# EAGLE design BB-M-1_0 (EAGLE 6.5.0)

## Sheet 1 of 3
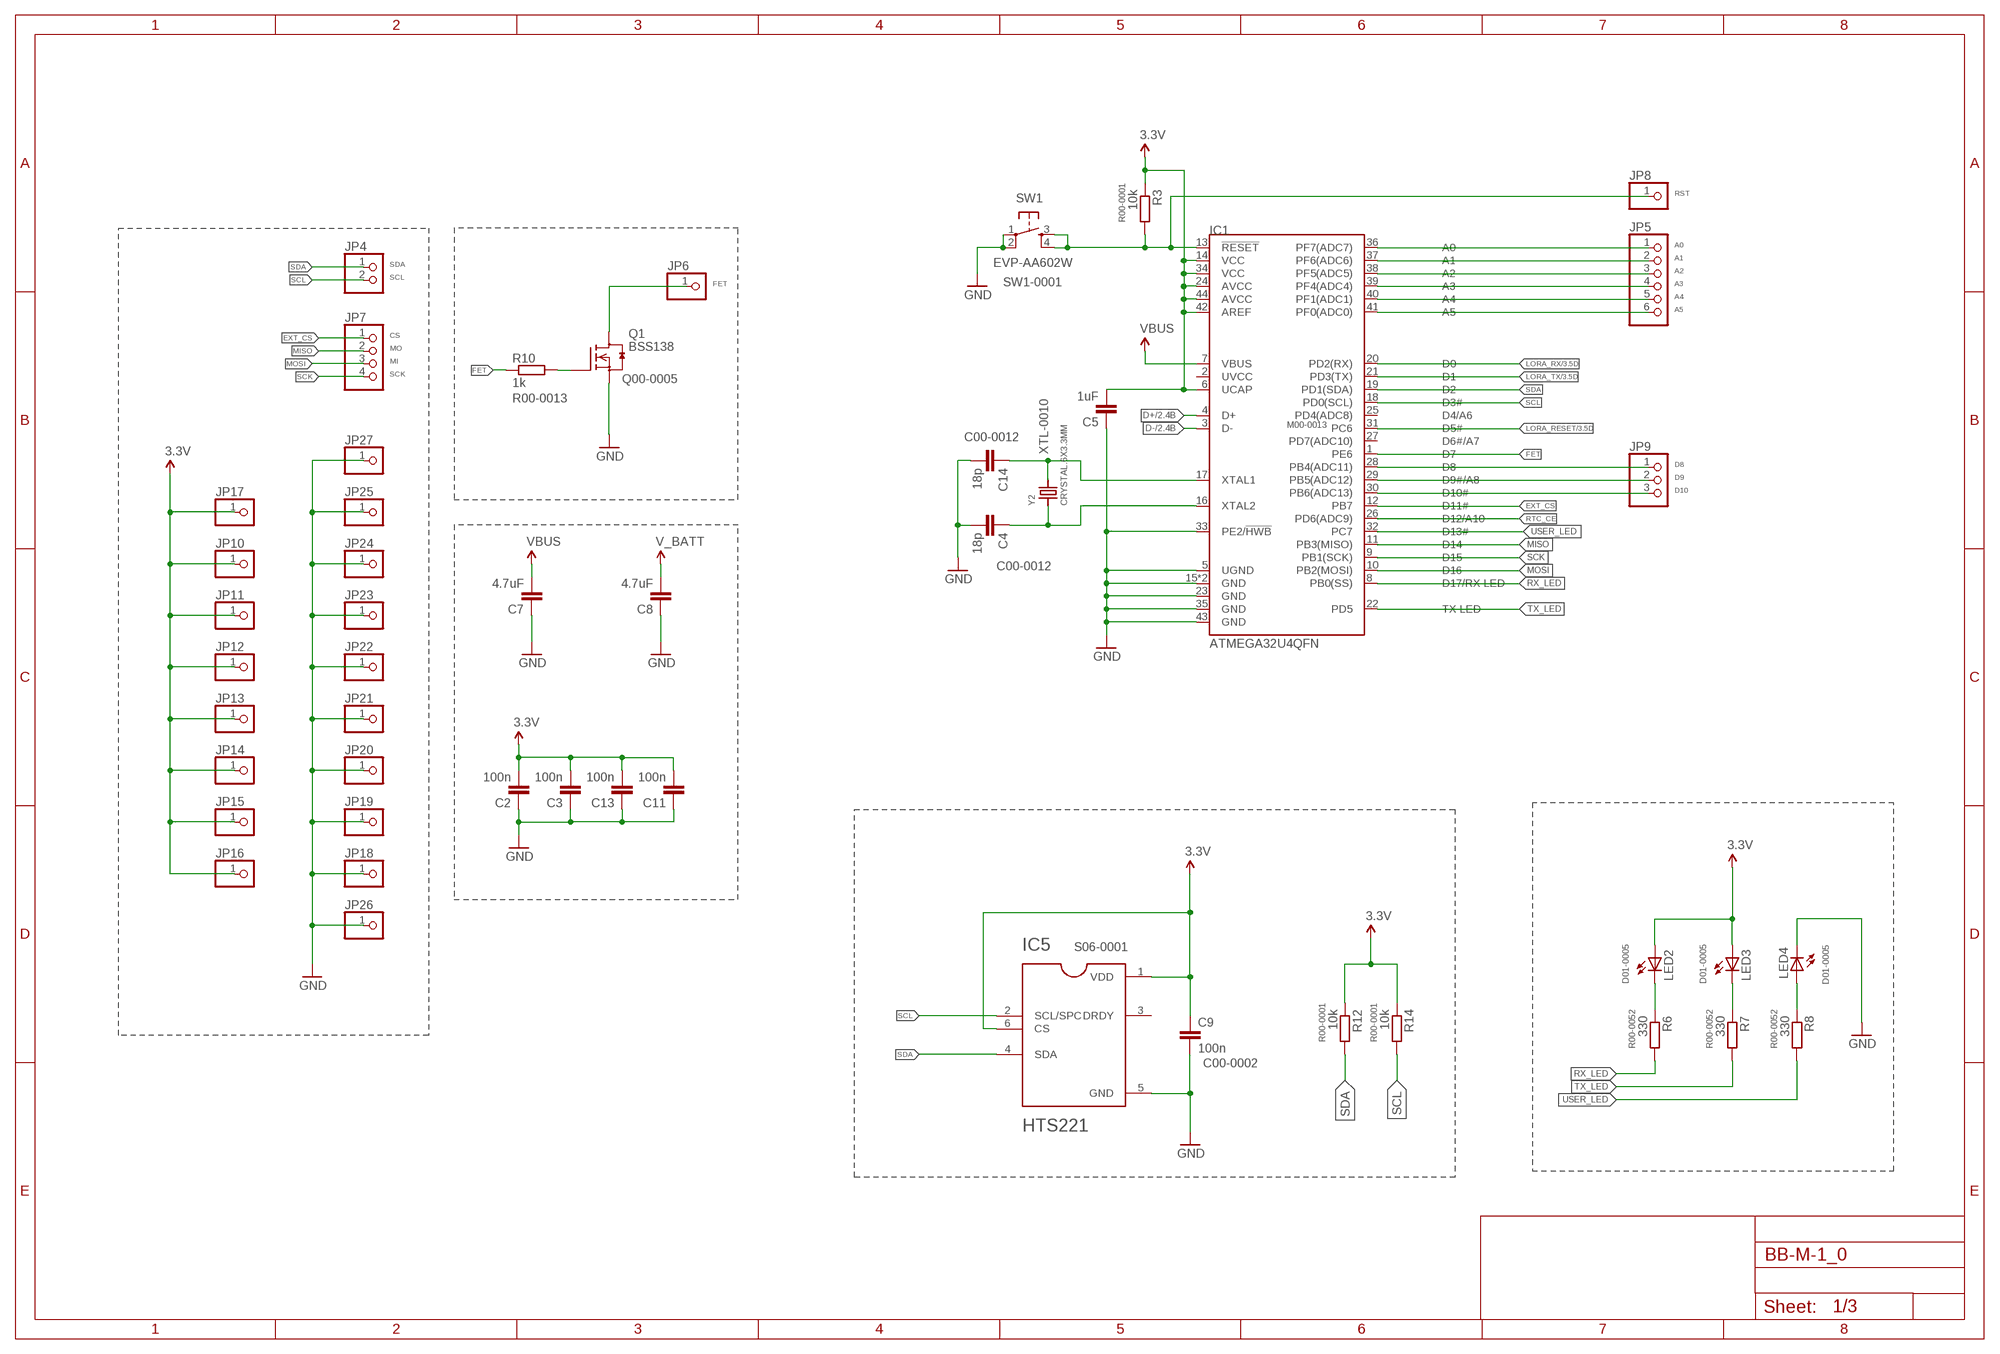
[diagram p0: schematic, sheet 1]

### Parts
C2  100n  C-EUC0402  [C0402]
C3  100n  C-EUC0402  [C0402]
C4  18p  C-EUC0402  [C0402]
C5  1uF  C-EUC0402  [C0402]
C7  4.7uF  C-EUC0603  [C0603]
C8  4.7uF  C-EUC0603  [C0603]
C9  100n  C-EUC0402  [C0402]
C11  100n  C-EUC0402  [C0402]
C13  100n  C-EUC0402  [C0402]
C14  18p  C-EUC0402  [C0402]
IC1  ATMEGA32U4QFN  [QFN-44]
IC5  HTS221  [LGA6R75P3X2_200X200X90]
JP4  HEADER-1X2ROUND  [1X02_ROUND]
JP5  HEADER-1X6ROUND  [1X06_ROUND]
JP6  HEADER-1X1ROUND  [1X01_ROUND]
JP7  HEADER-1X4ROUND  [1X04_ROUND]
JP8  HEADER-1X1ROUND  [1X01_ROUND]
JP9  HEADER-1X3ROUND  [1X03_ROUND]
JP10  HEADER-1X1ROUND  [1X01_ROUND]
JP11  HEADER-1X1ROUND  [1X01_ROUND]
JP12  HEADER-1X1ROUND  [1X01_ROUND]
JP13  HEADER-1X1ROUND  [1X01_ROUND]
JP14  HEADER-1X1ROUND  [1X01_ROUND]
JP15  HEADER-1X1ROUND  [1X01_ROUND]
JP16  HEADER-1X1ROUND  [1X01_ROUND]
JP17  HEADER-1X1ROUND  [1X01_ROUND]
JP18  HEADER-1X1ROUND  [1X01_ROUND]
JP19  HEADER-1X1ROUND  [1X01_ROUND]
JP20  HEADER-1X1ROUND  [1X01_ROUND]
JP21  HEADER-1X1ROUND  [1X01_ROUND]
JP22  HEADER-1X1ROUND  [1X01_ROUND]
JP23  HEADER-1X1ROUND  [1X01_ROUND]
JP24  HEADER-1X1ROUND  [1X01_ROUND]
JP25  HEADER-1X1ROUND  [1X01_ROUND]
JP26  HEADER-1X1ROUND  [1X01_ROUND]
JP27  HEADER-1X1ROUND  [1X01_ROUND]
LED2  LED0603  [LED-0603]
LED3  LED0603  [LED-0603]
LED4  LED0603  [LED-0603]
Q1  BSS138  [SOT23]
R3  10k  R-EU_R0402  [R0402]
R6  330  R-EU_R0402  [R0402]
R7  330  R-EU_R0402  [R0402]
R8  330  R-EU_R0402  [R0402]
R10  1k  R-EU_R0402  [R0402]
R12  10k  R-EU_R0402  [R0402]
R14  10k  R-EU_R0402  [R0402]
SW1  EVP-AA602W  SPST_TACT  [UUS_BUTTON]
Y2  CRYSTAL.6X3.3MM  [6X3.3MM]

### Nets
3.3V: C2.2 C3.2 C5.2 C9.1 C11.2 C13.2 IC1.6(UCAP) IC1.14(VCC) IC1.24(AVCC) IC1.34(VCC) IC1.42(AREF) IC1.44(AVCC) IC5.1(VDD) IC5.6(CS) JP10.1 JP11.1 JP12.1 JP13.1 JP14.1 JP15.1 JP16.1 JP17.1 LED2.A LED3.A R3.1 R12.1 R14.1 ; also sheet 2,3
5V: C7.2 IC1.7(VBUS) ; supply symbol labelled VBUS ; also sheet 2
D+: IC1.4(D+) ; also sheet 2
D-: IC1.3(D-) ; also sheet 2
EXT_CS: IC1.12(PB7) JP7.1
FET: IC1.1(PE6) R10.1
FET_OUTPUT: JP6.1 Q1.3(D)
GND: C2.1 C3.1 C4.2 C5.1 C7.1 C8.1 C9.2 C11.1 C13.1 C14.2 IC1.5(UGND) IC1.15(GND) IC1.23(GND) IC1.33(PE2/!HWB) IC1.35(GND) IC1.43(GND) IC1.EPAD(GND) IC5.5(GND) JP18.1 JP19.1 JP20.1 JP21.1 JP22.1 JP23.1 JP24.1 JP25.1 JP26.1 JP27.1 LED4.C Q1.2(S) SW1.1(P) SW1.2(P1) ; also sheet 2,3
LORA_RESET: IC1.31(PC6) ; also sheet 3
LORA_RX: IC1.20(PD2(RX)) ; also sheet 3
LORA_TX: IC1.21(PD3(TX)) ; also sheet 3
MISO: IC1.11(PB3(MISO)) JP7.2
MOSI: IC1.10(PB2(MOSI)) JP7.3
N$1: LED2.C R6.1
N$5: C14.1 IC1.17(XTAL1) Y2.2
N$7: C4.1 IC1.16(XTAL2) Y2.1
N$10: IC1.30(PB6(ADC13)) JP9.3
N$11: IC1.29(PB5(ADC12)) JP9.2
N$12: Q1.1(G) R10.2
N$13: IC1.36(PF7(ADC7)) JP5.1
N$14: IC1.41(PF0(ADC0)) JP5.6
N$15: IC1.40(PF1(ADC1)) JP5.5
N$16: IC1.39(PF4(ADC4)) JP5.4
N$17: IC1.38(PF5(ADC5)) JP5.3
N$18: LED4.A R8.1
N$21: LED3.C R7.1
N$25: IC1.37(PF6(ADC6)) JP5.2
N$28: IC1.28(PB4(ADC11)) JP9.1
RESET: IC1.13(!RESET) JP8.1 R3.2 SW1.3(S) SW1.4(S1)
RTC_CE: IC1.26(PD6(ADC9))
RX_LED: IC1.8(PB0(SS)) R6.2
SCK: IC1.9(PB1(SCK)) JP7.4
SCL: IC1.18(PD0(SCL)) IC5.2(SCL/SPC) JP4.2 R14.2
SDA: IC1.19(PD1(SDA)) IC5.4(SDA) JP4.1 R12.2
TX_LED: IC1.22(PD5) R7.2
USER_LED: IC1.32(PC7) R8.2
V_BATT: C8.2 ; also sheet 2
Unconnected: IC1.2(UVCC) IC1.25(PD4(ADC8)) IC1.27(PD7(ADC10)) IC5.3(DRDY)

### Notes on the sheet
- RST
- A0
- A1
- SDA
- A2
- SCL
- FET | A3
- A4
- A5
- CS
- MO
- MI
- SCK
- D8
- D9
- D10

## Sheet 2 of 3
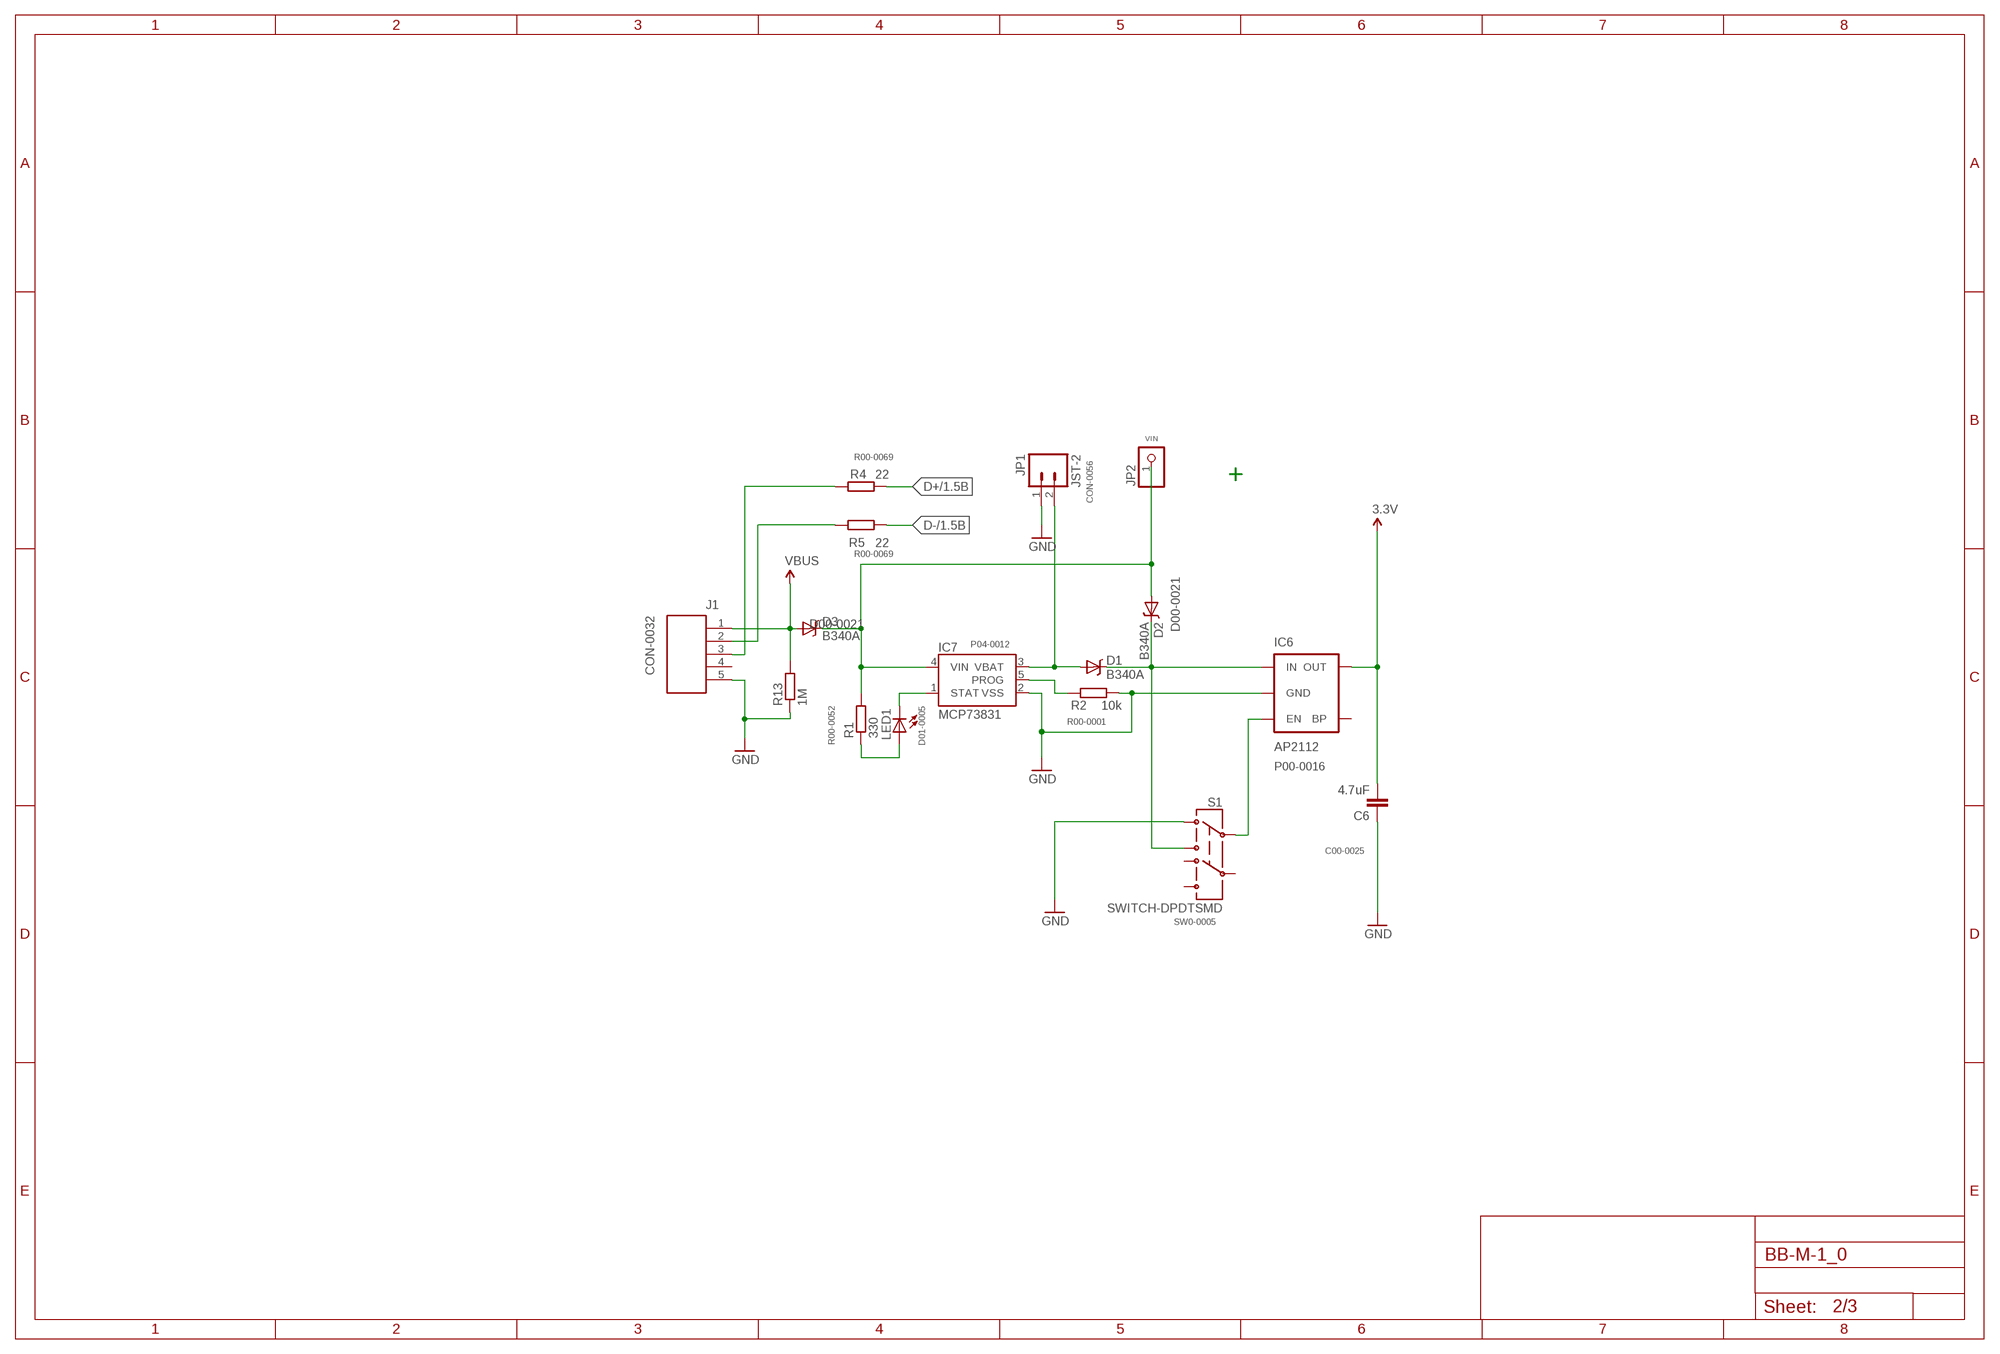
[diagram p1: schematic, sheet 2]

### Parts
C6  4.7uF  C-EUC0603  [C0603]
D1  B340A  DIODE-SCHOTTKY_  [SMA-DIODE]
D2  B340A  DIODE-SCHOTTKY_  [SMA-DIODE]
D3  B340A  DIODE-SCHOTTKY_  [SMA-DIODE]
IC6  AP2112  V_REG_MIC5219SMD  [SOT23-5]
IC7  MCP73831  [SOT23-5]
J1  629105136821  [629105136821]
JP1  JST-2  M02-JST-2MM-SMT  [JST-2-SMD]
JP2  PINHD-1X1CB  [1X01-CLEANBIG]
LED1  LED0603  [LED-0603]
R1  330  R-EU_R0402  [R0402]
R2  10k  R-EU_R0402  [R0402]
R4  22  R-EU_R0402  [R0402]
R5  22  R-EU_R0402  [R0402]
R13  1M  R-EU_R0402  [R0402]
S1  SWITCH-DPDTSMD  [AYZ0202]

### Nets
3.3V: C6.2 IC6.5(OUT) ; also sheet 1,3
5V: D3.A J1.1 R13.2 ; supply symbol labelled VBUS ; also sheet 1
D+: R4.1 ; also sheet 1
D-: R5.1 ; also sheet 1
GND: C6.1 IC6.2(GND) IC7.2(VSS) J1.5 JP1.1 R2.1 R13.1 S1.1 ; also sheet 1,3
N$2: D1.C D2.C IC6.1(IN) S1.3
N$3: LED1.A R1.1
N$4: IC7.1(STAT) LED1.C
N$6: IC7.5(PROG) R2.2
N$8: IC6.3(EN) S1.2
N$19: J1.2 R5.2
N$20: J1.3 R4.2
N$29: D2.A D3.C IC7.4(VIN) JP2.1 R1.2
V_BATT: D1.A IC7.3(VBAT) JP1.2 ; also sheet 1
Unconnected: IC6.4(BP) J1.4 S1.4 S1.5 S1.6

### Notes on the sheet
- VIN
- +

## Sheet 3 of 3
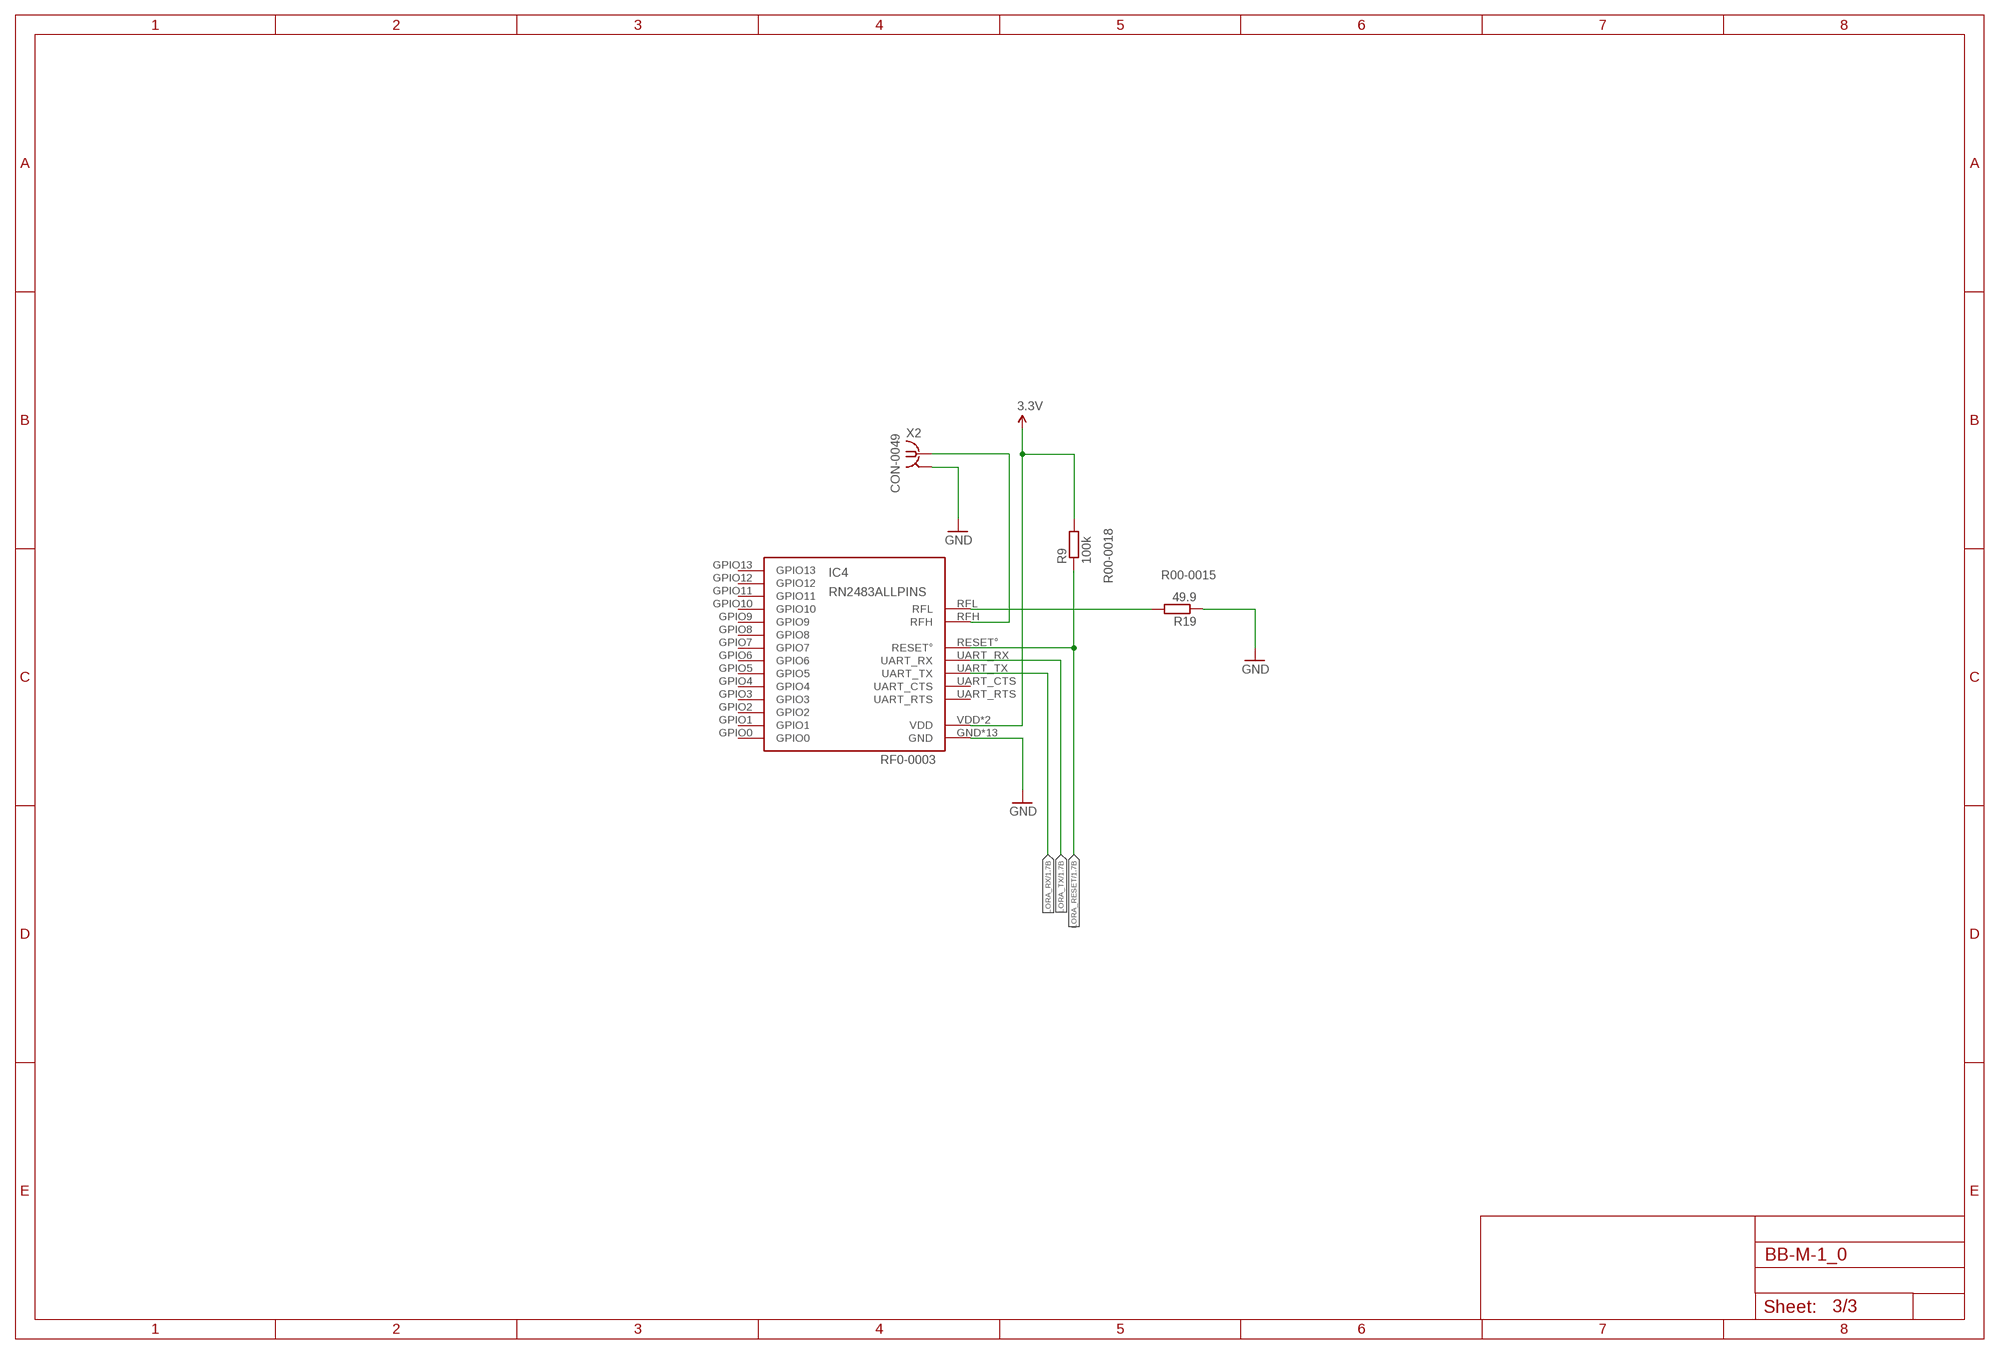
[diagram p2: schematic, sheet 3]

### Parts
IC4  RN2483ALLPINS  [RN2483]
R9  100k  R-EU_R0402  [R0402]
R19  49.9  R-EU_R0402  [R0402]
X2  132414  [132414]

### Nets
3.3V: IC4.VDD IC4.VDD2(VDD) R9.2 ; also sheet 1,2
GND: IC4.GND IC4.GND1(GND) IC4.GND2(GND) IC4.GND3(GND) IC4.GND4(GND) IC4.GND5(GND) IC4.GND6(GND) IC4.GND7(GND) IC4.GND8(GND) IC4.GND9(GND) IC4.GND10(GND) IC4.GND11(GND) IC4.GND12(GND) R19.1 X2.G@1(GND) X2.G@2(GND) X2.G@3(GND) X2.G@4(GND) ; also sheet 1,2
LORA_RESET: IC4.RESET° R9.1 ; also sheet 1
LORA_RX: IC4.UART_TX ; also sheet 1
LORA_TX: IC4.UART_RX ; also sheet 1
N$30: IC4.RFL R19.2
N$34: IC4.RFH X2.1
Unconnected: IC4.GPIO0 IC4.GPIO1 IC4.GPIO2 IC4.GPIO3 IC4.GPIO4 IC4.GPIO5 IC4.GPIO6 IC4.GPIO7 IC4.GPIO8 IC4.GPIO9 IC4.GPIO10 IC4.GPIO11 IC4.GPIO12 IC4.GPIO13 IC4.UART_CTS IC4.UART_RTS

## Library data of the parts
C2 C3 C9 C11 C13 = passive_comp:C-EU: CAPACITOR, European symbol; NASPN: C00-0002
C4 C14 = passive_comp:C-EU: CAPACITOR, European symbol; NASPN: C00-0012
C5 = passive_comp:C-EU: CAPACITOR, European symbol; NASPN: C00-0008
C6-C8 = passive_comp:C-EU: CAPACITOR, European symbol; NASPN: C00-0025
D1-D3 = SparkFun-DiscreteSemi:DIODE-SCHOTTKY: Commonly MBRA140.; NASPN: D00-0021
IC1 = SparkFun-DigitalIC:ATMEGA32U4: Atmel 44-pin 8-bit Microcontroller with 32KBytes of ISP Flash and USB Controller; NASPN: M00-0013
IC4 = LORA:RN2483: RN2483 Microchip Low-Power Lora Transceiver Module NOT TESTED There are testpads on the bottom of the device. The mask is supposed to cover that, but I have not tested it in practice yet. Info: http://www.microchip.com/wwwproducts/Devices.aspx?product=RN2483 Datasheet: http://ww1.microchip.com/downloads/en/DeviceDoc/50002346B.pdf Adapted from: https://github.com/Octanis1/Octanis1-Electronics/blob/ae493cac28c100e20856abe563dfe8824e9cc4bd/lib/Octanis1.lbr; NASPN: RF0-0003
IC5 = HTS221:HTS221: Capacitive digital sensor for relative humidity and temperature; NASPN: S06-0001
IC6 = SparkFun-PowerIC:V_REG_MIC5219: V_REG MIC5219 Standard 500mA LDO voltage regulator in SOT-23 layout. Micrel part MIC5219. BP (by-pass) pin is used to lower output noise with 470pF cap, may be left open.; NASPN: P00-0016
IC7 = SparkFun-PowerIC:MCP73831: Miniature single cell, fully integrated Li-Ion, Li-polymer charge management controller http://ww1.microchip.com/downloads/en/DeviceDoc/21984a.pdf; NASPN: P04-0012
J1 = EAGLE-INPUT_OUTPUT_CONNECTORS-rev1:629105136821: WR-COM SMT Horizontal 5 Contacts Micro USB Type B,5 pins=>Code : Con_I-O_COM_MicroUSB_629105136821 <http://katalog.we-online.de/media/images/eican/Con_I-O_COM_MicroUSB_629105136821_pf2.jpg> Details see: http://katalog.we-online.de/en/em/629_105_136_821 Created 2014-07-09, Karrer Zheng 2014 (C) Würth Elektronik; NASPN: CON-0032
JP1 = SparkFun-Connectors:M02: Header 2 Standard 2-pin 0.1" header. Use with straight break away headers (SKU : PRT-00116), right angle break away headers (PRT-00553), swiss pins (PRT-00743), machine pins (PRT-00117), and female headers (PRT-00115). Molex polarized connector foot print use with SKU : PRT-08233 with associated crimp pins and housings.; NASPN: CON-0056
JP2 = adafruit:PINHD-1X1: Pin header 1x1 for 0.1" spacing With round pins
JP4 = microbuilder:HEADER-1X2: PIN HEADER
JP5 = microbuilder:HEADER-1X6: PIN HEADER
JP6 JP8 JP10-JP27 = microbuilder:HEADER-1X1: PIN HEADER
JP7 = microbuilder:HEADER-1X4: PIN HEADER
JP9 = microbuilder:HEADER-1X3: PIN HEADER
LED1-LED4 = SparkFun-LED:LED: LEDs Standard schematic elements and footprints for 5mm, 3mm, 1206, and 0603 sized LEDs. 5mm - Spark Fun Electronics SKU : COM-00529 (and others); NASPN: D01-0005
Q1 = MAX9812:BSS138: Fairchild Semiconductors BSS138 N-Channel Logic Level Enhancement Mode Field Effect Transistor General Description: These N-Channel enhancement mode field effect transistors are produced using Fairchild's proprietary, high cell density, DMOS technology. These products have been designed to minimize on-state resistance while provide rugged, reliable, and fast switching performance.These products are particularly suited for low voltage, low current applications such as small servo motor control, power MOSFET gate drivers, and other switching applications. Features: 0.22 A, 50 V. RDS(ON) = 3.5Ohm @ VGS = 10 V RDS(ON) = 6.0Ohm @ VGS = 4.5 V High density cell design for extremely low RDS(ON) Rugged and Reliable Compact industry standard SOT-23 surface mount package Please send any comments to: messi@users.sourceforge.net; NASPN: Q00-0005
R1 R6-R8 = passive_comp:R-EU_: RESISTOR, European symbol; NASPN: R00-0052
R2 R3 R12 R14 = passive_comp:R-EU_: RESISTOR, European symbol; NASPN: R00-0001
R4 R5 = passive_comp:R-EU_: RESISTOR, European symbol; NASPN: R00-0069
R9 = passive_comp:R-EU_: RESISTOR, European symbol; NASPN: R00-0018
R10 = passive_comp:R-EU_: RESISTOR, European symbol; NASPN: R00-0013
R13 = passive_comp:R-EU_: RESISTOR, European symbol; NASPN: R00-0004
R19 = passive_comp:R-EU_: RESISTOR, European symbol; NASPN: R00-0015
S1 = SparkFun-Electromechanical:SWITCH-DPDT: DPDT Version of the COM-00597; NASPN: SW0-0005
SW1 = adafruit:SPST_TACT: SMT 6mm switch, EVQQ2 series http://www.ladyada.net/library/eagle; NASPN: SW1-0001
X2 = con-coax:132414; NASPN: CON-0049
Y2 = abracon:CRYSTAL; NASPN: XTL-0010

## Board
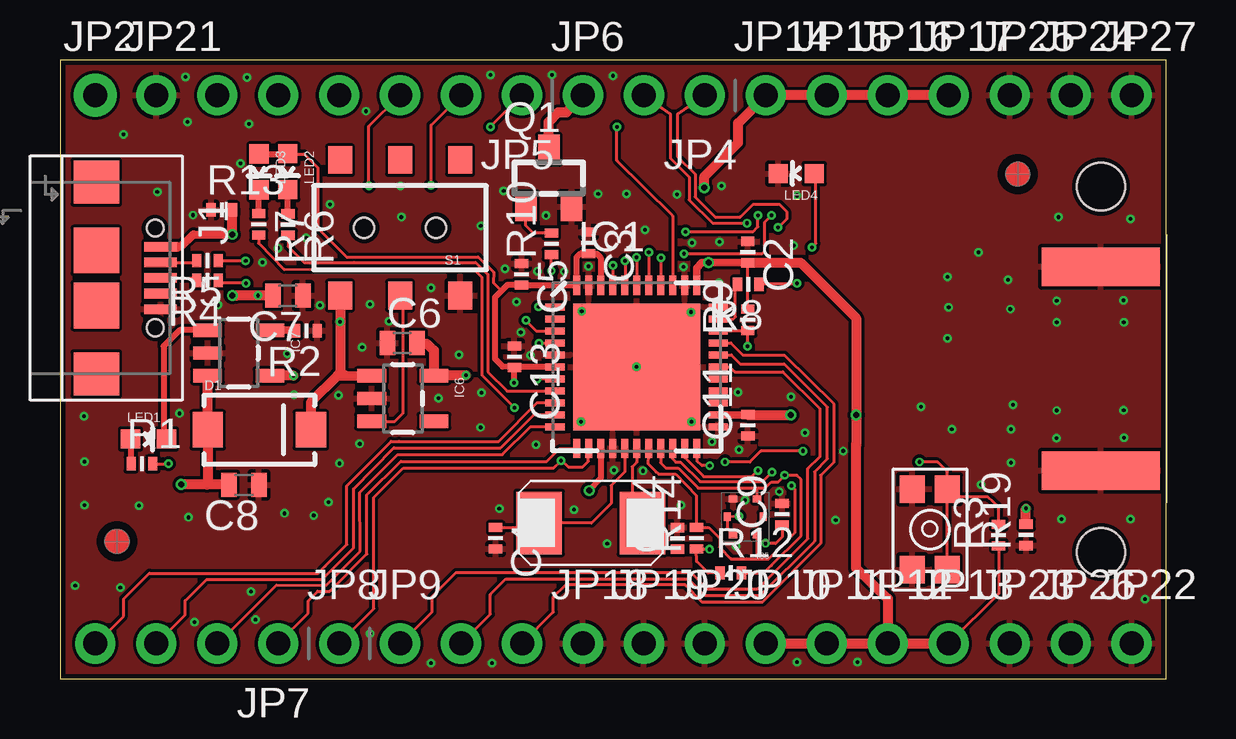
[diagram p3: board, top side]
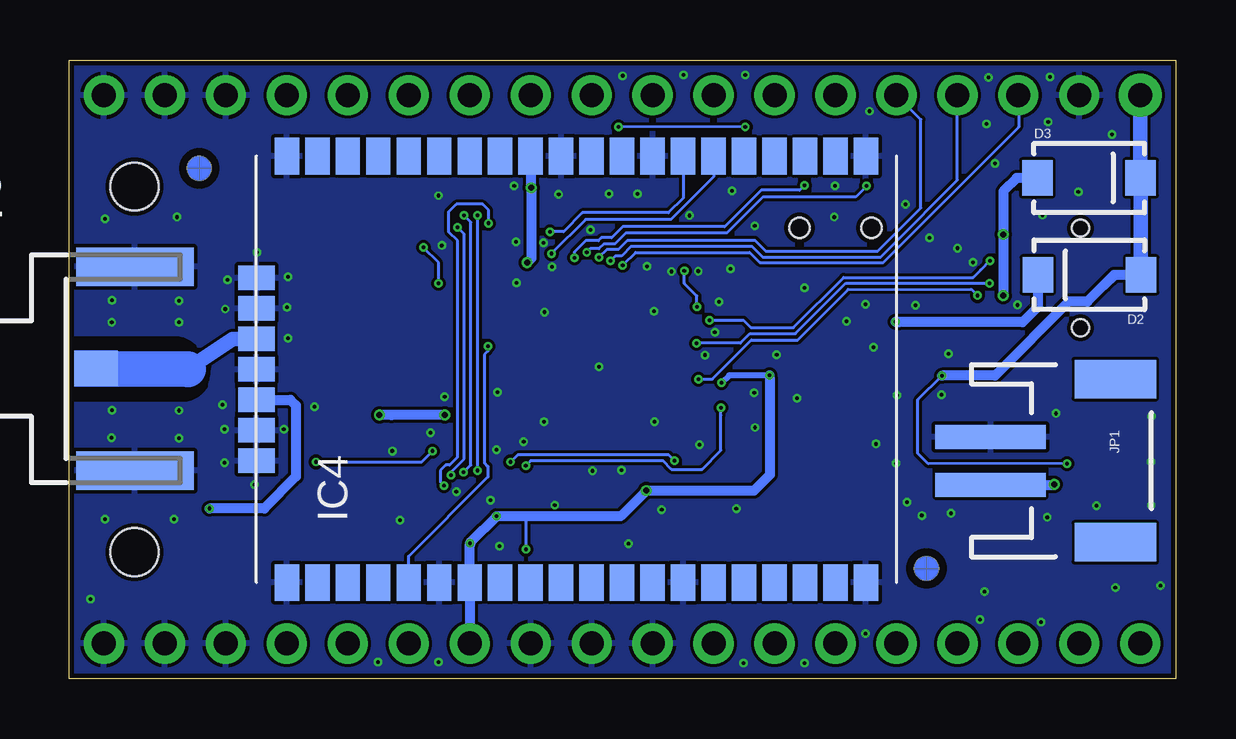
[diagram p4: board, bottom side, seen from below]

Size 46.11 x 25.8 mm. Coordinates in mm from the lower left corner, seen from the top.
Outline: 0,0 46.1,0 46.1,25.8 0,25.8 0,0
Copper layers (1*16): Top 0.012mm / dielectric 1mm / Bottom 0.012mm
Design rules "brandner *": minimum track width 3mil, minimum drill 0.099059375mm, track to track 0.05mm, track to pad 0.05mm, pad to pad 0.05mm, via to via 0.05mm, smd to smd 0.05mm, copper to edge 8mil, drill to drill 8mil, minimum pad ring 6mil, minimum via ring 4mil, stop-mask expansion 1mil, vias tented up to drill 10mil, thermal gap 6mil
Holes 2 mm at 43.38,5.28 43.38,20.52
bRestrict: 5 lines

### Footprints (pad centres in the part's own frame; a part is rotated, then mirrored left to right if it is on the bottom)
C0402 = smd 0.381 x 0.559: 1 -0.448,0; 2 0.448,0
C0603 = smd 0.643 x 1: 1 -0.621,0; 2 0.621,0
SMA-DIODE = smd 1.27 x 1.47: A -2.15,0; C 2.15,0
QFN-44 = smd 0.8 x 0.3: 1 -3.4,2.5; 2 -3.4,2; 3 -3.4,1.5; 4 -3.4,1; 5 -3.4,0.5; 6 -3.4,0; 7 -3.4,-0.5; 8 -3.4,-1; 9 -3.4,-1.5; 10 -3.4,-2; 11 -3.4,-2.5; 23 3.4,-2.5; 24 3.4,-2; 25 3.4,-1.5; 26 3.4,-1; 27 3.4,-0.5; 28 3.4,0; 29 3.4,0.5; 30 3.4,1; 31 3.4,1.5; 32 3.4,2; 33 3.4,2.5 | smd 0.3 x 0.8: 12 -2.5,-3.4; 13 -2,-3.4; 14 -1.5,-3.4; 15 -1,-3.4; 16 -0.5,-3.4; 17 0,-3.4; 18 0.5,-3.4; 19 1,-3.4; 20 1.5,-3.4; 21 2,-3.4; 22 2.5,-3.4; 34 2.5,3.4; 35 2,3.4; 36 1.5,3.4; 37 1,3.4; 38 0.5,3.4; 39 0,3.4; 40 -0.5,3.4; 41 -1,3.4; 42 -1.5,3.4; 43 -2,3.4; 44 -2.5,3.4 | smd 5.3 x 5.3: EPAD 0,0
RN2483 = smd 1.524 x 1.016: GND 17.78,1.27; GND1 17.78,10.16; GND2 17.78,13.97; GND3 17.78,25.4; GND9 0,25.4; GND10 0,19.05; GND11 0,8.89; GND12 0,1.27; GPIO0 0,16.51; GPIO1 0,15.24; GPIO2 0,13.97; GPIO3 0,12.7; GPIO4 0,11.43; GPIO5 0,10.16; GPIO6 0,6.35; GPIO7 0,5.08; GPIO8 0,3.81; GPIO9 0,2.54; GPIO10 17.78,17.78; GPIO11 17.78,16.51; GPIO12 17.78,12.7; GPIO13 17.78,11.43; P$1 0,21.59; P$2 0,22.86; P$3 0,24.13; P$4 17.78,24.13; P$5 17.78,22.86; P$6 17.78,21.59; P$7 17.78,20.32; P$8 17.78,19.05; P$9 17.78,6.35; P$10 17.78,5.08; P$11 0,7.62; RESET° 0,20.32; UART_CTS 17.78,3.81; UART_RTS 17.78,2.54; UART_RX 17.78,8.89; UART_TX 17.78,7.62; VDD 17.78,15.24; VDD2 0,17.78 | smd 1.016 x 1.524: GND4 12.7,26.67; GND5 11.43,26.67; GND6 8.89,26.67; GND7 6.35,26.67; GND8 5.08,26.67; RFH 10.16,26.67; RFL 7.62,26.67
LGA6R75P3X2_200X200X90 = smd 0.35 x 0.3: 1 0.5,0.75; 2 -0.5,0.75; 4 -0.5,-0.75; 5 0.5,-0.75 | smd 0.3 x 0.35: 3 -0.75,0; 6 0.75,0
SOT23-5 = smd 0.55 x 1.2: 1 -0.95,-1.3; 2 0,-1.3; 3 0.95,-1.3; 4 0.95,1.3; 5 -0.95,1.3
629105136821 = smd 0.4 x 1.35: 1 -1.3,0; 2 -0.65,0; 3 0,0; 4 0.65,0; 5 1.3,0 | smd 1.8 x 1.9: Z1 -4,-2.675; Z4 4,-2.675 | smd 1.9 x 1.9: Z2 -1.15,-2.675; Z3 1.15,-2.675 | hole 0.7: -2.075,-0.225; 2.075,-0.225
JST-2-SMD = smd 1 x 4.6: 1 -1,-3.7; 2 1,-3.7 | smd 1.6 x 3.4: NC1 -3.4,1.5; NC2 3.4,1.5
1X01-CLEANBIG = drill 1.016 pad 1.778: 1 0,0
1X02_ROUND = drill 1 pad 1.676: 1 -1.27,0; 2 1.27,0
1X06_ROUND = drill 1 pad 1.676: 1 -6.35,0; 2 -3.81,0; 3 -1.27,0; 4 1.27,0; 5 3.81,0; 6 6.35,0
1X01_ROUND = drill 1 pad 1.676: 1 0,0
1X04_ROUND = drill 1 pad 1.676: 1 -3.81,0; 2 -1.27,0; 3 1.27,0; 4 3.81,0
1X03_ROUND = drill 1 pad 1.676: 1 -2.54,0; 2 0,0; 3 2.54,0
LED-0603 = smd 0.8 x 0.8: A 0,-0.75; C 0,0.75
SOT23 = smd 0.9 x 1.2: 1 -0.95,-1.2; 2 0.95,-1.2; 3 0,1.2
R0402 = smd 0.381 x 0.559: 1 -0.448,0; 2 0.448,0
AYZ0202 = smd 1 x 1.15: 1 -2.5,2.825; 2 0,2.825; 3 2.5,2.825; 4 -2.5,-2.825; 5 0,-2.825; 6 2.5,-2.825 | hole 0.85: 1.5,0; -1.5,0
UUS_BUTTON = smd 1.15 x 1.05: 1 -1.68,0.73; 2 1.68,0.73; 3 -1.68,-0.72; 4 1.68,-0.73
132414 = smd 1.8 x 1.5: 1 1.13,0 | smd 4.9 x 1.6: G@1 2.75,4.25; G@2 2.75,-4.25 | smd 4.9 x 1.6 bottom: G@3 2.75,4.25; G@4 2.75,-4.25
6X3.3MM = smd 1.9 x 2.6: 1 -2.15,0; 2 2.15,0

### Placement (x,y rotation side)
C2  28.66,17.79 270 top
C3  22.02,18.17 270 top
C4  18.15,5.86 270 top
C5  19.23,16.86 270 top
C6  14.26,13.99 0 top
C7  9.5,15.97 180 top
C8  7.67,8.09 180 top
C9  30.09,6.87 90 top
C11  28.66,10.57 90 top
C13  18.93,13.42 270 top
C14  25.73,5.85 90 top
D1  8.31,10.38 0 top
D2  3.59,16.84 180 bottom
D3  3.6,20.88 0 bottom
IC1  24.03,13 0 top
IC4  11.63,4.01 90 bottom
IC5  28.55,6.75 180 top
IC6  14.29,11.69 270 top
IC7  7.45,13.58 270 top
J1  4.19,16.71 270 top
JP1  4.01,9.09 270 bottom
JP2  1.47,24.33 0 top
JP4  25.6,24.33 180 top
JP5  12.9,24.33 180 top
JP6  21.79,24.33 0 top
JP7  5.28,1.47 180 top
JP8  11.63,1.47 0 top
JP9  16.71,1.47 0 top
JP10  29.41,1.47 0 top
JP11  31.95,1.47 0 top
JP12  34.49,1.47 0 top
JP13  37.03,1.47 0 top
JP14  29.41,24.33 0 top
JP15  31.95,24.33 0 top
JP16  34.49,24.33 0 top
JP17  37.03,24.33 0 top
JP18  21.79,1.47 0 top
JP19  24.33,1.47 0 top
JP20  26.87,1.47 0 top
JP21  4.01,24.33 0 top
JP22  44.65,1.47 0 top
JP23  39.57,1.47 0 top
JP24  42.11,24.33 0 top
JP25  39.57,24.33 0 top
JP26  42.11,1.47 0 top
JP27  44.65,24.33 0 top
LED1  3.69,9.99 270 top
LED2  9.49,21.14 180 top
LED3  8.29,21.13 180 top
LED4  30.68,21.06 90 top
Q1  20.37,20.88 0 top
R1  3.41,8.96 0 top
R2  10.28,14.51 180 top
R3  39.11,5.99 90 top
R4  6.14,16.61 180 top
R5  6.14,17.44 180 top
R6  9.5,18.94 270 top
R7  8.28,18.94 270 top
R8  28.68,16.44 180 top
R9  28.66,14.97 90 top
R10  20.48,18.14 90 top
R12  27.95,4.41 0 top
R13  6.74,19.54 0 top
R14  26.52,5.86 90 top
R19  40.26,6 90 top
S1  14.17,18.8 180 top
SW1  36.24,6.22 90 top
U$1  [FIDUCIAL_L10]  2.37,5.73 0 top
U$2  [FIDUCIAL_L10]  39.91,21.04 0 top
U$3  [FIDUCIAL_L10]  10.38,4.61 0 bottom
U$4  [FIDUCIAL_L10]  40.68,21.28 0 bottom
X2  46.11,12.93 0 bottom
Y2  22.11,6.49 0 top

### Tracks (layer width: path | path; a pad name or v marks a point on that pad's centre or on a via)
3.3V  (via drill 0.15, 0.15 pad 0.3, 0.25 pad 0.3)
  Top 0.127: 9.49,21.88 10.17,21.88 10.74,21.31 10.74,18.8 11.94,17.58 17.43,17.58 18.06,16.95 18.06,16.52 18.23,16.35 18.4,16.18 | IC5.1 27.8,6.28 IC5.6 v28.3,6.78 | R9.2 C2.2 | R3.1 39.11,3.55 JP13.1 | C9.1 30.09,5.91 29.82,5.64 29.41,5.64 v29.4,5.65 | R12.1 27.01,4.41 26.53,4.88 26.52,5.37 R14.1 26.67,5.38 v27.06,5.39
  Top 0.254: LED3.A 9.49,21.88 LED2.A | IC1.6 18.95,13 | 18.95,13 C13.2 18.92,12.96 v18.92,12.33 | IC1.14 22.52,8.34 v22.06,7.84 | 18.95,13 18.45,13.01 18.13,13.33 18.13,15.91 18.4,16.18 18.65,16.43 C5.2 19.25,16.42 21.51,16.42 IC1.44 21.52,17.57 21.68,17.72 C3.2 22.37,17.72 22.52,17.56 22.52,16.42 IC1.42
  Top 0.305: IC1.34 26.52,17.13 26.74,17.34 v27.02,17.34 C2.2 28.61,17.34 | IC1.24 28.65,11 C11.2
  Top 0.406: JP10.1 JP11.1 JP12.1 | JP12.1 JP13.1 | JP17.1 JP16.1 JP15.1 JP14.1 28.25,23.17 28.25,22.35 26.84,20.94 v26.84,20.47 | 28.65,11 30.45,11 v30.45,10.99 | JP12.1 34.49,3.34 33.17,4.62 33.17,9.68 33.17,9.78 v33.17,11 33.17,15.03 30.86,17.34 28.61,17.34 | v16.91,12.65 15.6,12.65 IC6.5 15.57,12.65 15.57,13.69 15.27,13.97 C6.2
  Bottom 0.127: v27.06,5.39 27.06,6.7 27.14,6.78
  Bottom 0.254: v16.91,12.65 18.6,12.65 v18.92,12.33
  Bottom 0.406: JP10.1 IC4.VDD2 29.41,5.56 v29.4,5.65 29.32,5.75 28.31,6.75 v28.3,6.78 28.28,6.78 27.14,6.78 23.12,6.78 v22.06,7.84 17.56,7.84 16.89,8.52 16.89,12.46 v16.91,12.65 | IC4.VDD 26.84,21.77 v26.84,20.47 26.84,17.52 v27.02,17.34 | v30.45,10.99 32.66,10.99 v33.17,11
5V  (via drill 0.15, 0.15 pad 0.3, 0.25)
  Top 0.127: IC1.7 19.93,12.5 v19.87,12.49 | C7.2 8.27,15.97 v8.25,15.98 | 7.19,19.25 R13.2
  Top 0.33: 4.88,18.01 5.03,18.01 5.56,18.53 v7.19,18.53
  Top 0.406: C7.2 7.33,15.97 v7.19,15.97 | J1.1 4.88,18.01 | v7.19,18.53 7.18,19.41 R13.2
  Bottom 0.127: v8.25,15.98 8.27,15.98 v8.26,15.98 v8.25,15.98 8.51,16.25 13.65,16.23 15.74,14.12 17.68,14.12 19.3,12.49 v19.87,12.49 | 7.17,16.74 7.17,16.04 7.2,16.01 7.2,15.98 v7.19,15.97
  Bottom 0.406: v7.19,15.97 v7.19,18.53 7.18,18.48 7.17,20.32 6.62,20.88 D3.A
D+  (via drill 0.15 pad 0.35)
  Top 0.127: v19.96,13.99 20.62,13.99 | v7.75,16.49 6.71,16.49 R4.1
  Top 0.254: 20.62,13.99 IC1.4
  Bottom 0.127: v19.96,13.99 18.14,13.99 17.74,14.38 15.84,14.38 13.74,16.49 v7.75,16.49
D-  (via drill 0.15 pad 0.3)
  Top 0.127: R5.1 v7.74,17.43 | 19.4,14.93 19.83,14.5 IC1.3
  Top 0.254: v19.42,14.95 19.4,14.93 | IC1.3
  Bottom 0.127: v7.74,17.43 8.12,17.04 8.43,16.73 13.83,16.73 15.92,14.64 17.7,14.64 18,14.95 v19.42,14.95
EXT_CS
  Top 0.127: IC1.12 20.82,9.6 20.29,9.06 14.2,9.06 12.79,7.67 12.79,5.2 11.23,3.64 10.74,3.64 10.33,3.24 10.33,2.74 9.09,1.49 | 9.09,1.49 | JP7.1 9.09,1.49
FET  (via drill 0.15 pad 0.3)
  Top 0.127: IC1.1 20.23,15.5 v19.95,15.5 | v20.47,17.02 20.47,17.6 R10.1
  Bottom 0.127: v19.95,15.5 19.95,15.96 20.47,16.48 v20.47,17.02
FET_OUTPUT
  Top 0.305: 20.35,22.09 Q1.3
  Top 0.406: 20.35,22.09 20.36,23.22 20.74,23.61 21.1,23.62 JP6.1
GND  (via drill 0.15 pad 0.3)
  other vias: 2.51,3.81 1.01,7.24 3.29,7.22 1,10.95 28.55,7.44 22.02,17.19 29.97,7.79 27.45,16.51 18.3,7.1 15.47,0.66 12.93,1.88 9.35,6.9 7.96,3.64 8.15,2.46 45.21,3.32 5.61,2.36 18.01,0.66 19.83,9.75 21.01,16.98 27.16,9.88 13.71,14.9 20.49,25.17 17.93,25.17 4.05,20.3 7.79,25.07 5.23,25.09 5.31,23.21 11.25,19.78 14.22,19.25 17.53,18.88 23.03,25.14 12.59,13.82 28.29,9.55 28.17,5.53 15.46,16.3 31.04,10.26 30.71,0.7 33.24,0.69 32.32,6.61 32.64,9.5 24.03,13 12.75,23.66 2.65,22.69 5.54,19.33 27.48,18.21 26.34,18.18 27.56,20.55 18.54,17.08 22.43,20.22 18.49,20.34 12.92,15.62 19.2,14.45 19.89,17 9.09,17.95 16.62,13.51 10.57,6.81 30.72,20.14 30.57,18.06 24.38,18.72 25.7,20.19 30.45,11.76 28.26,11.94 11.61,11.82 7.87,23.14 9.75,11.85 17.56,11.92 14.2,20.55 1.02,9.05 12.49,9.79 41.73,6.65 44.6,6.65 44.6,19.17 41.6,19.25 25.98,17.17 21.74,15.31 26.29,15.29 26.31,10.72 21.71,10.72 5.35,6.73 36.98,16.76 38.27,17.78 39.49,16.63 37.03,15.49 35.88,11.35 39.71,11.42 39.6,15.41 36.98,14.2 39.62,10.41 39.62,9.01 38.38,8.1 37.16,10.41 41.53,15.77 44.31,15.77 41.53,10.03 44.33,10.06 41.53,14.87 44.32,14.87 41.53,11.19 44.32,11.19 10.26,18.39 7.52,21.49 22.8,5.64 21.41,7.06 25.87,7.24 0.63,3.88 11.18,7.36 11.65,8.98 17.53,10.48 23.09,8.69 24.29,8.67 19.6,13.5 19.03,15.71 9.47,13.56 10.83,15.57 23.6,20.22 15.78,11.69 6.59,15.58 4.99,11.06 8.44,17.36 20.25,19.31
  pour Top (isolate 0.127): 0.2,0.2 0.2,25.6 45.92,25.6 45.92,0.2
  pour Bottom (isolate 0.127): 0.2,0.2 0.2,25.6 45.92,25.6 45.92,0.2
LORA_RESET  (via drill 0.15 pad 0.3)
  Top 0.127: v28.65,13.86 28.65,14.51 R9.1 28.64,14.5 IC1.31
  Bottom 0.127: IC4.RESET° 31.95,5.1 28.65,8.41 28.65,8.86 28.8,9.01 28.8,13.51 28.65,13.66 v28.65,13.86
LORA_RX  (via drill 0.15 pad 0.3)
  Top 0.127: v26.01,17.73 29.26,17.73 29.36,17.83 29.36,19.04 v29.64,19.32 | v29.66,8.61 29.28,8.23 26.67,8.23 25.85,9.04 25.65,9.04 25.52,9.16 IC1.20
  Bottom 0.127: IC4.UART_TX 19.25,20.93 21.03,19.15 24.58,19.15 v26.01,17.73 | v29.66,8.61 29.36,8.91 29.36,19.04 v29.64,19.32
LORA_TX  (via drill 0.15 pad 0.3)
  Top 0.127: v29.08,8.68 28.82,8.43 26.82,8.43 26.02,9.22 IC1.21 | v26.06,18.64 28.88,18.64 29.08,18.84 v29.08,19.33
  Bottom 0.127: IC4.UART_RX 20.52,20.04 21.13,19.43 24.71,19.43 25.5,18.64 v26.06,18.64 | v29.08,8.68 v29.08,19.33
MISO
  Top 0.127: JP7.2 6.86,1.75 9.02,3.91 11.09,3.9 12.5,5.31 12.5,7.77 14.07,9.34 18.44,9.34 19.61,10.51 20.61,10.51 IC1.11
MOSI
  Top 0.127: IC1.10 19.74,11 18.36,9.62 13.91,9.62 12.23,7.92 12.23,5.45 10.93,4.14 6.11,4.14 5.21,3.25 5.21,2.66 4.03,1.47 JP7.3
N$1
  Top 0.254: R6.1 9.49,19.38 LED2.C
N$2  (via drill 0.15)
  Top 0.406: D1.C 10.47,11.55 11.56,12.65 11.87,12.65 | 11.87,12.65 12.97,12.63 IC6.1 | S1.3 v11.67,14.89 v11.67,14.88 11.67,12.63 11.87,12.65
  Bottom 0.406: D2.C 5.74,15.49 6.37,14.87 11.52,14.87 v11.67,14.88
N$3
  Top 0.254: R1.1 2.97,10.01 LED1.A
N$4
  Top 0.254: IC7.1 4.98,14.53 4.32,13.86 4.32,10.19 LED1.C
N$5
  Top 0.127: 24.96,6.75 Y2.2 | C14.1 24.5,5.42 Y2.2 | 24.02,6.73 Y2.2 | IC1.17 24.02,9.02 23.84,8.83 23.84,6.92 Y2.2
  Top 0.254: IC1.17
N$6
  Top 0.305: IC7.5 9.86,14.53 R2.2
N$7
  Top 0.127: C4.1 19.71,6.32 Y2.1 22.15,6.5 22.96,7.31 22.96,8.05 23.52,8.61 IC1.16
N$8
  Top 0.127: 14.23,16.38 S1.2 14.29,16.35 14.3,11.08 13.95,10.73 IC6.3
N$10
  Top 0.127: IC1.30 27.95,14 28.47,13.48 30.2,13.48 32.26,11.45 32.26,9.04 31.7,8.48 31.7,5.64 29.26,3.19 26.76,3.2 26.04,3.91 21.06,3.91 20.56,3.41 20.56,2.78 JP9.3
N$11
  Top 0.127: IC1.29 27.97,13.5 28.34,13.13 30.17,13.13 31.97,11.32 31.97,9.17 31.44,8.63 31.44,5.74 29.15,3.47 26.87,3.47 26.19,4.15 26.17,4.16 18.57,4.16 17.93,3.52 17.93,2.69 16.73,1.5 16.73,1.47 JP9.2
N$12
  Top 0.127: Q1.1 19.41,18.88 19.71,18.59 R10.2
N$13  (via drill 0.15 pad 0.3)
  Top 0.127: JP5.1 v17.93,23.01 | IC1.36 25.52,19.3 23.21,21.61 v23.21,23
  Bottom 0.127: v17.93,23.01 v23.21,23
N$14  (via drill 0.15 pad 0.3)
  Top 0.127: v23.04,17.24 IC1.41
  Bottom 0.127: v23.04,17.24 22.5,17.78 17.75,17.78 17.32,17.36 12.18,17.36 11.76,17.78 6.54,23 JP5.6
N$15  (via drill 0.15 pad 0.3)
  Top 0.127: v23.54,17.42 23.54,16.39 IC1.40
  Bottom 0.127: v23.54,17.42 23.34,17.62 23.09,17.62 22.68,18.03 17.65,18.03 17.21,17.58 12.28,17.58 11.83,18.03 9.09,20.8 JP5.5
N$16  (via drill 0.15 pad 0.3)
  Top 0.127: v24.02,17.57 IC1.39 | IC1.39
  Bottom 0.127: v24.02,17.57 23.7,17.9 23.21,17.9 22.83,18.29 17.53,18.29 17.08,17.84 12.41,17.84 10.61,19.63 10.61,23.31 JP5.4
N$17  (via drill 0.15 pad 0.3)
  Top 0.127: v24.53,17.78 IC1.38 | v12.88,20.54 12.88,23.04 JP5.3
  Bottom 0.127: v12.88,20.54 13.33,20.09 17.19,20.09 18.69,18.59 22.91,18.59 23.36,18.13 23.82,18.13 24.02,17.93 24.38,17.93 v24.53,17.78
N$18  (via drill 0.15 pad 0.3)
  Top 0.127: R8.1 29.17,16.44 29.21,16.48 v30.7,16.48 | LED4.A 31.49,21.08 31.49,18.16 v31.34,17.98
  Bottom 0.127: v30.7,16.48 30.7,17.34 v31.34,17.98
N$19
  Top 0.127: J1.2 5.56,17.36 R5.2
  Top 0.254: 5.71,17.36 R5.2
N$20
  Top 0.127: 5.7,16.71 R4.2 5.57,16.71 J1.3
N$21
  Top 0.254: R7.1 LED3.C
N$25  (via drill 0.15 pad 0.3)
  Top 0.127: v25.04,17.55 25.04,16.42 IC1.37 | v15.46,20.57 15.46,23.09 JP5.2
  Bottom 0.127: v25.04,17.55 25.04,17.8 24.58,18.26 24.05,18.26 23.92,18.39 23.49,18.39 23.04,18.84 18.79,18.84 17.27,20.37 15.67,20.37 v15.46,20.57
N$28
  Top 0.127: IC1.28 27.91,13 28.11,12.8 30.12,12.8 31.67,11.25 31.67,9.27 31.16,8.76 31.16,5.84 29.04,3.74 26.98,3.74 26.3,4.42 16.49,4.42 15.51,3.43 15.51,2.78 14.19,1.47 JP9.1
N$29  (via drill 0.15)
  Top 0.127: R1.2 4.49,8.96 v4.52,8.97
  Top 0.406: 8.83,12.64 IC7.4 8.76,12.64 v9.73,12.64
  Bottom 0.127: v4.52,8.97 10.29,8.96 10.74,9.39 10.74,11.63 v9.73,12.64
  Bottom 0.406: 2.66,16.74 2.99,16.41 | 2.99,16.41 3.68,15.72 4.45,15.73 7.52,12.64 v9.73,12.64 | D2.A 2.56,16.84 2.99,16.41
  Bottom 0.61: JP2.1 1.47,20.9 D3.C 1.45,16.86 D2.A
N$30  (via drill 0.15)
  Top 0.406: R19.2 40.25,6.51 v40.25,7.1
  Bottom 0.406: IC4.RFL 36.88,11.63 36.65,11.4 36.65,8.43 37.97,7.1 v40.25,7.1
N$34
  Bottom 0.61: 41.15,12.9 39.29,14.17 IC4.RFH
  Bottom 1.499: X2.1 41.15,12.9
RESET  (via drill 0.15 pad 0.3)
  Top 0.127: IC1.13 22.02,9.59 22.02,9.06 21.79,8.84 21.18,8.84 20.93,9.09 v20.88,9.09 20.57,8.79 14.31,8.79 13.08,7.56 13.08,2.92 JP8.1 | R3.2 39.11,7.16 38.66,7.59 36.98,7.59 SW1.4 | v30.96,9.5 29.21,9.5 28.75,9.04 v27.71,9.04 | SW1.3 36.96,7.58 SW1.4 | SW1.4 36.97,8.64 36.57,9.04 v35.81,9.04
  Bottom 0.127: 27.66,9.09 v27.71,9.04 27.42,9.32 21.11,9.32 v20.88,9.09 | v35.81,9.04 31.42,9.04 v30.96,9.5
RTC_CE
  Top 0.127: 27.44,11.99 IC1.26
RX_LED
  Top 0.127: IC1.8 20.59,12 18.62,12 17.83,12.8 17.83,16.86 17.32,17.36 12.24,17.36 10.17,17.36 9.5,18.02 R6.2
SCK
  Top 0.127: IC1.9 19.87,11.5 18.29,9.9 14.12,9.9 13.8,9.9 11.96,8.05 11.96,5.59 11.04,4.68 10.76,4.4 3.72,4.4 2.65,3.33 2.65,2.61 1.51,1.47 JP7.4
SCL  (via drill 0.15 pad 0.3)
  Top 0.127: IC1.18 24.5,8.97 24.84,8.62 24.86,8.62 24.94,8.53 25.65,8.53 26.5,7.65 26.5,6.32 R14.2 27.03,6.31 27.48,5.85 27.48,5.48 27.96,5 28.6,5 29.05,5.01 | 29.05,5.01 IC5.2 | 29.05,5.01 29.54,5 30.63,6.09 30.63,7.9 v30.48,8.05 | v28.62,19 27.2,19 26.21,19.96 26.21,20.92 25.45,21.69 25.45,23.54 JP4.2
  Bottom 0.127: v28.62,19 28.62,19.53 28.88,19.78 29.97,19.78 30.27,19.48 30.27,18.61 29.92,18.26 29.92,9.24 30.25,8.91 30.4,8.91 30.63,8.68 30.63,8.2 v30.48,8.05
SDA  (via drill 0.15 pad 0.3)
  Top 0.127: IC1.19 25.02,9 25.24,8.79 25.75,8.79 26.59,7.95 29.03,7.95 | IC5.4 29.05,7.86 29.03,7.95 | 29.03,7.95 29.38,7.95 29.64,8.2 29.92,8.2 v30.2,8.48 30.7,8.48 30.88,8.3 30.88,5.97 29.64,4.72 29.33,4.41 R12.2 | v29.92,18.82 30.27,19.17 30.27,19.48 29.97,19.78 28.88,19.78 28.34,19.25 27.3,19.25 26.46,20.09 26.46,21.04 25.73,21.77 25.73,23.54 JP4.1
  Bottom 0.127: v30.2,8.48 30.2,8.61 29.64,9.17 29.64,18.54 v29.92,18.82
TX_LED  (via drill 0.15 pad 0.3)
  Top 0.127: R7.2 8.28,18.15 9.35,17.07 17.24,17.08 17.57,16.74 17.57,12.66 v18.95,11.29 | v27.07,8.89 26.74,8.89 26.54,9.09 26.54,9.59 IC1.22
  Bottom 0.127: v27.07,8.89 26.88,9.08 21.36,9.09 21,8.73 19.73,8.73 18.95,9.52 18.95,10.98 18.93,11.29 v18.94,11.28 v18.95,11.29
USER_LED
  Top 0.127: IC1.32 28.06,15 28.14,15.08 28.14,16.35 R8.2
V_BATT  (via drill 0.25)
  Top 0.406: D1.A IC7.3 | 6.14,10.36 D1.A | C8.2 7.04,8.1 6.12,8.1 | 6.12,8.1 v5.05,8.1 | D1.A 6.16,8.29 6.12,8.1
  Bottom 0.406: JP1.2 5.09,8.09 v5.05,8.1

### Text on the board
tStop: VIN | GND | A5 | A4 | A3 | A2 | A1 | A0 | FET | SCL | SDA | 3V3 | 3V3 | 3V3 | GND | GND | TX | RX | v2.0 | SCK | MO | MI | CS | RST | D8 | D9 | D10 | GND | GND | 3V3 | 3V3 | 3V3 | GND | GND
200bmp: /Users/viljo/Desktop/badgerboard.io.BMP